# EAGLE design SPV1040 (EAGLE 7.1.0)
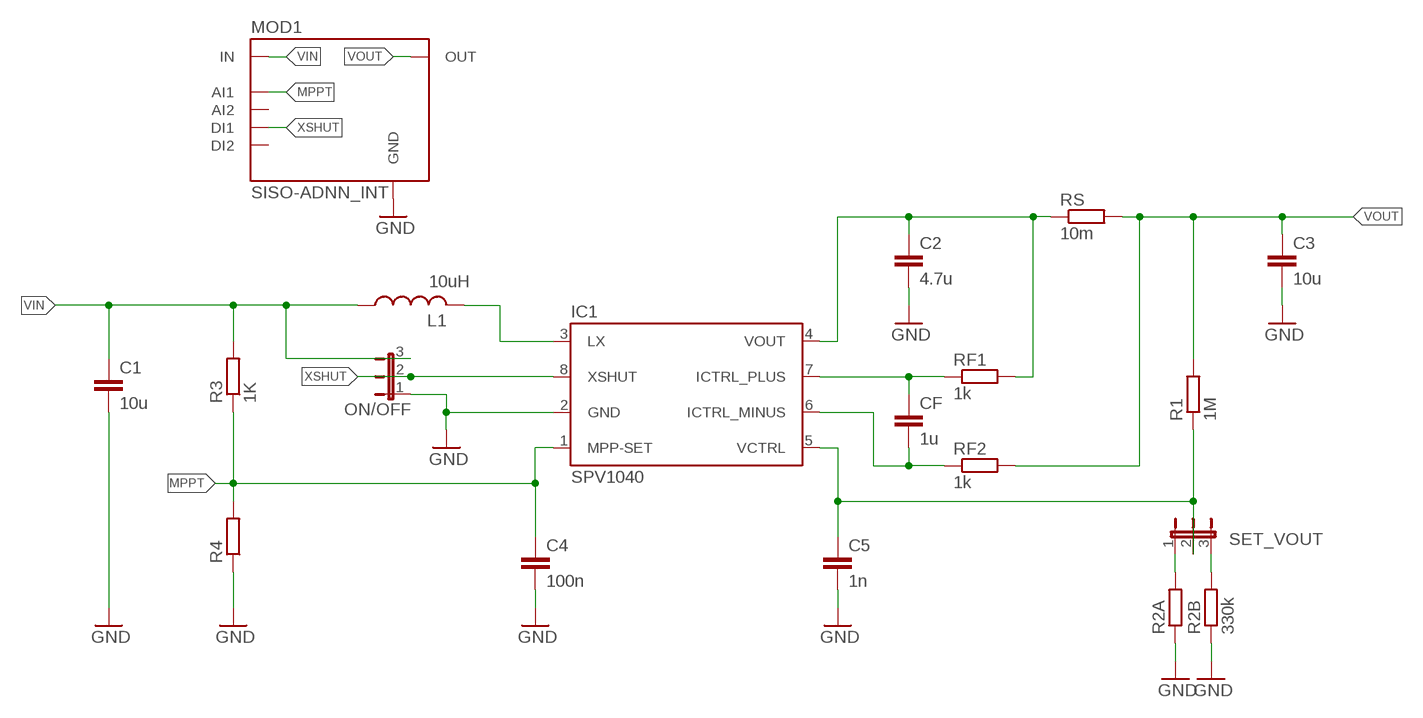
[diagram p0: schematic, sheet 1]

## Parts
C1  10u  C-EUC0805  [C0805]
C2  4.7u  C-EUC0805  [C0805]
C3  10u  C-EUC0805  [C0805]
C4  100n  C-EUC0805  [C0805]
C5  1n  C-EUC0805  [C0805]
CF  1u  C-EUC0805  [C0805]
IC1  SPV1040  [TSSOP8]
L1  IHLP-2525CZ-01  [2525]
MOD1  SISO-ADNN_INT  [SISO-ADNN]
ON/OFF  JP2E  [JP2]
R1  1M  R-EU_R0805  [R0805]
R2A  R-EU_R0805  [R0805]
R2B  330k  R-EU_R0805  [R0805]
R3  1K  R-EU_R0805  [R0805]
R4  R-EU_R0805  [R0805]
RF1  1k  R-EU_R0805  [R0805]
RF2  1k  R-EU_R0805  [R0805]
RS  10m  R-EU_R0805  [R0805]
SET_VOUT  JP2E  [JP2]

## Nets
GND: C1.2 C2.2 C3.2 C4.2 C5.2 IC1.2(GND) ON/OFF.1 R2A.1 R2B.1 R4.1
MPPT: C4.1 IC1.1(MPP-SET) MOD1.AI1 R3.1 R4.2
N$1: IC1.3(LX) L1.P$1
N$3: CF.2 IC1.6(ICTRL_MINUS) RF2.1
N$4: CF.1 IC1.7(ICTRL_PLUS) RF1.1
N$6: C2.1 IC1.4(VOUT) RF1.2 RS.1
N$8: C5.1 IC1.5(VCTRL) R1.1 SET_VOUT.2
N$10: R2A.2 SET_VOUT.1
N$11: R2B.2 SET_VOUT.3
VIN: C1.1 L1.P$2 MOD1.IN1(IN) MOD1.IN2(IN) MOD1.IN3(IN) MOD1.IN4(IN) ON/OFF.3 R3.2
VOUT: C3.1 MOD1.OUT1_1(OUT) MOD1.OUT1_2(OUT) MOD1.OUT1_3(OUT) MOD1.OUT1_4(OUT) R1.2 RF2.2 RS.2
XSHUT: IC1.8(XSHUT) MOD1.DI1 ON/OFF.2
Unconnected: MOD1.AI2 MOD1.DI2

## Notes on the sheet
- 10uH

## Power pins joined to a net without a drawn wire
GND: MOD1.GND1(GND) MOD1.GND2(GND) MOD1.GND3(GND) MOD1.GND4(GND)

## Library data of the parts
C1-C5 CF = rcl:C-EU: CAPACITOR, European symbol
IC1 = SPV1040:SPV1040
L1 = IHLP2525CZ-11:IHLP-2525CZ-01
MOD1 = AllModules:SISO-ADNN_INT
ON/OFF SET_VOUT = Jumper_mod:JP2E: JUMPER
R1 R2A R2B R3 R4 RF1 RF2 RS = rcl:R-EU_: RESISTOR, European symbol

## Board
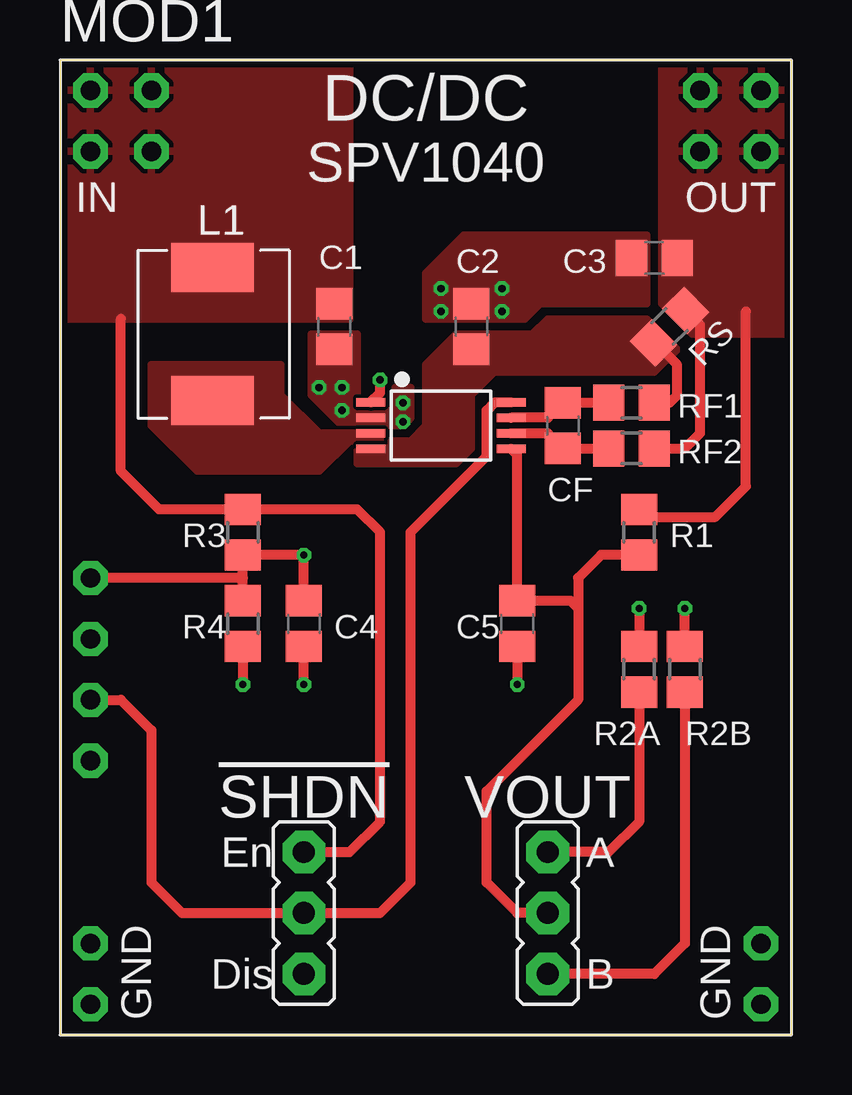
[diagram p1: board, top side]
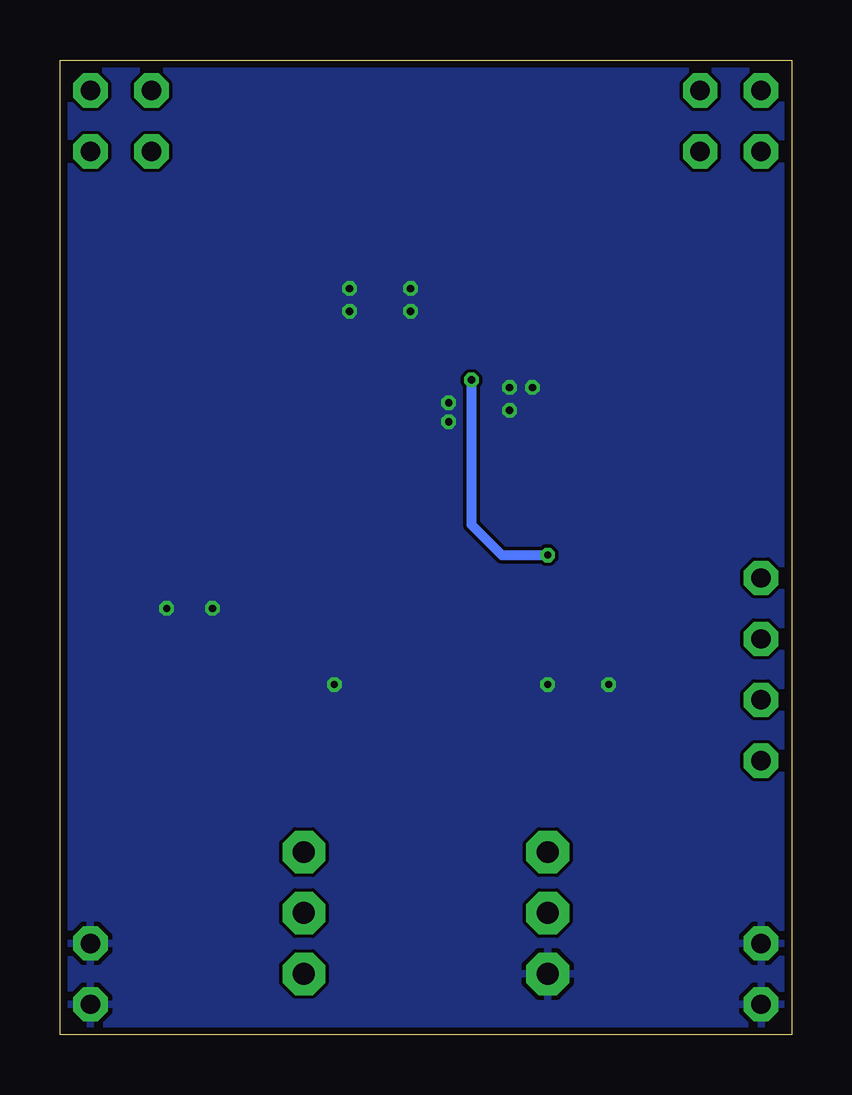
[diagram p2: board, bottom side, seen from below]

Size 30.48 x 40.64 mm. Coordinates in mm from the lower left corner, seen from the top.
Outline: 0,0 30.48,0 30.48,40.64 0,40.64 0,0
Copper layers (1*16): Top 0.035mm / dielectric 1.5mm / Bottom 0.035mm
Design rules "PCB-POOL Standard *": minimum track width 0.15mm, minimum drill 0.3mm, track to track 0.15mm, track to pad 0.15mm, pad to pad 0.15mm, via to via 0.15mm, smd to smd 0.15mm, copper to edge 0.3mm, drill to drill 0.2mm, minimum pad ring 0.2mm, minimum via ring 0.15mm, stop-mask expansion 0.075mm, vias tented up to drill 0mil, thermal gap 0.2mm

### Footprints (pad centres in the part's own frame; a part is rotated, then mirrored left to right if it is on the bottom)
C0805 = smd 1.3 x 1.5: 1 -0.95,0; 2 0.95,0
TSSOP8 = smd 1.2 x 0.35: 1 -2.925,0.975; 2 -2.925,0.325; 3 -2.925,-0.325; 4 -2.925,-0.975; 5 2.925,-0.975; 6 2.925,-0.325; 7 2.925,0.325; 8 2.925,0.975
2525 = smd 2.032 x 3.429: P$1 2.769,0; P$2 -2.769,0
SISO-ADNN = drill 0.8 pad 1.422 octagon: AI1 1.27,-21.59; AI2 1.27,-24.13; DI1 1.27,-26.67; DI2 1.27,-29.21; GND1 1.27,-39.37; GND2 1.27,-36.83; GND3 29.21,-36.83; GND4 29.21,-39.37; IN1 1.27,-1.27; IN2 1.27,-3.81; IN3 3.81,-1.27; IN4 3.81,-3.81; OUT1_1 26.67,-1.27; OUT1_2 26.67,-3.81; OUT1_3 29.21,-1.27; OUT1_4 29.21,-3.81
JP2 = drill 0.914 pad 1.778 octagon: 1 -2.54,0; 2 0,0; 3 2.54,0
R0805 = smd 1.3 x 1.5: 1 -0.95,0; 2 0.95,0

### Placement (x,y rotation side)
C1  11.43,29.53 270 top
C2  17.14,29.53 90 top
C3  24.77,32.38 180 top
C4  10.16,17.14 270 top
C5  19.05,17.14 270 top
CF  20.95,25.4 270 top
IC1  15.88,25.4 0 top
L1  6.35,29.21 270 top
MOD1  0,40.64 0 top
ON/OFF  10.16,5.08 90 top
R1  24.13,20.96 90 top
R2A  24.13,15.24 270 top
R2B  26.04,15.24 270 top
R3  7.62,20.96 90 top
R4  7.62,17.14 90 top
RF1  23.81,26.35 0 top
RF2  23.81,24.45 0 top
RS  25.4,29.53 45 top
SET_VOUT  20.32,5.08 270 top

### Tracks (layer width: path | path; a pad name or v marks a point on that pad's centre or on a via)
GND  (via drill 0.3)
  Top 0.406: R2B.1 v26.04,17.78 | C5.2 v19.05,14.61 | v10.16,14.61 C4.2 | R4.1 v7.62,14.61 | v24.13,17.78 R2A.1
  other vias: 10.79,26.99 11.75,26.04 18.41,30.16 15.88,30.16 14.29,25.56 14.29,26.35 18.41,31.12 15.88,31.12 11.75,26.99
  pour Top (rank 2, no thermals): 14.29,25.4 11.75,25.4 10.48,26.67 10.48,29.21 12.38,29.21 12.38,26.04 13.97,26.04 13.97,26.99 14.61,26.99 14.61,25.72
  pour Top (no thermals): 15.24,29.84 19.37,29.84 20,30.48 24.45,30.48 24.45,33.34 16.83,33.34 15.24,31.75
  pour Bottom: -0.64,41.27 31.11,41.27 31.11,-0.63 -0.64,-0.63
MPPT  (via drill 0.3)
  Top 0.406: R4.2 7.62,19.05 | 7.62,19.05 R3.1 v10.16,20 C4.1 | 7.62,19.05 MOD1.AI1 | IC1.1 13.34,26.76 v13.34,27.3
  Bottom 0.406: v13.34,27.3 13.34,21.27 12.06,20 v10.16,20
N$1
  pour Top (no thermals): 3.81,27.94 3.81,25.4 5.71,23.5 10.79,23.5 12.06,24.77 13.34,24.77 13.34,25.08 10.79,25.08 9.21,26.67 9.21,27.94
N$3
  Top 0.406: IC1.6 20.33,25.08 CF.2 RF2.1
N$4
  Top 0.406: IC1.7 20.33,25.73 CF.1 RF1.1
N$6
  Top 0.406: RF1.2 25.4,26.35 25.72,26.67 25.72,27.94 25.09,28.57 25.01,28.57 RS.1
  pour Top (rank 3, no thermals): 12.38,24.77 12.38,23.81 16.51,23.81 17.14,24.45 17.14,26.67 18.1,27.62 24.77,27.62 25.72,28.58 24.45,29.84 20.32,29.84 19.68,29.21 16.51,29.21 15.24,27.94 15.24,25.4 14.61,24.77
N$8
  Top 0.406: SET_VOUT.2 19.05,5.08 17.78,6.35 17.78,10.16 21.59,13.97 21.59,17.78 | 21.59,17.78 21.59,19.05 22.55,20 R1.1 | IC1.5 19.05,24.18 C5.1 21.27,18.09 21.59,17.78
N$10
  Top 0.406: R2A.2 24.13,8.89 22.86,7.62 SET_VOUT.1
N$11
  Top 0.406: R2B.2 26.04,3.81 24.77,2.54 SET_VOUT.3
VIN
  Top 0.406: 2.54,29.84 2.54,23.5 4.13,21.91 R3.2 12.38,21.91 13.34,20.96 13.34,8.89 12.06,7.62 ON/OFF.3
  pour Top (no thermals): 0,34.29 12.06,34.29 12.06,29.84 0,29.84
  pour Top: 0,40.64 12.06,40.64 12.06,34.29 0,34.29
VOUT
  Top 0.406: 28.57,30.16 28.57,22.86 27.3,21.59 24.13,21.59 R1.2 | RF2.2 26.04,24.45 26.67,25.08 26.67,29.6 RS.2
  pour Top (no thermals): 26.35,29.21 25.08,30.48 25.08,34.29 30.48,34.29 30.48,29.21
  pour Top: 25.08,34.29 25.08,40.64 30.48,40.64 30.48,34.29
XSHUT
  Top 0.406: IC1.8 18.12,26.38 17.78,26.04 17.78,24.13 14.61,20.96 14.61,6.35 13.34,5.08 ON/OFF.2 5.08,5.08 3.81,6.35 3.81,12.7 2.54,13.97 MOD1.DI1

### Text on the board
tNames: DC/DC | SPV1040 | En | !SHDN | VOUT | A | Dis | B
bStop: Kokert / 26.01.2016